# Altium schematic sheet motor_drivers.SchDoc
size A4; SheetNumber: 3; SheetTotal: 3
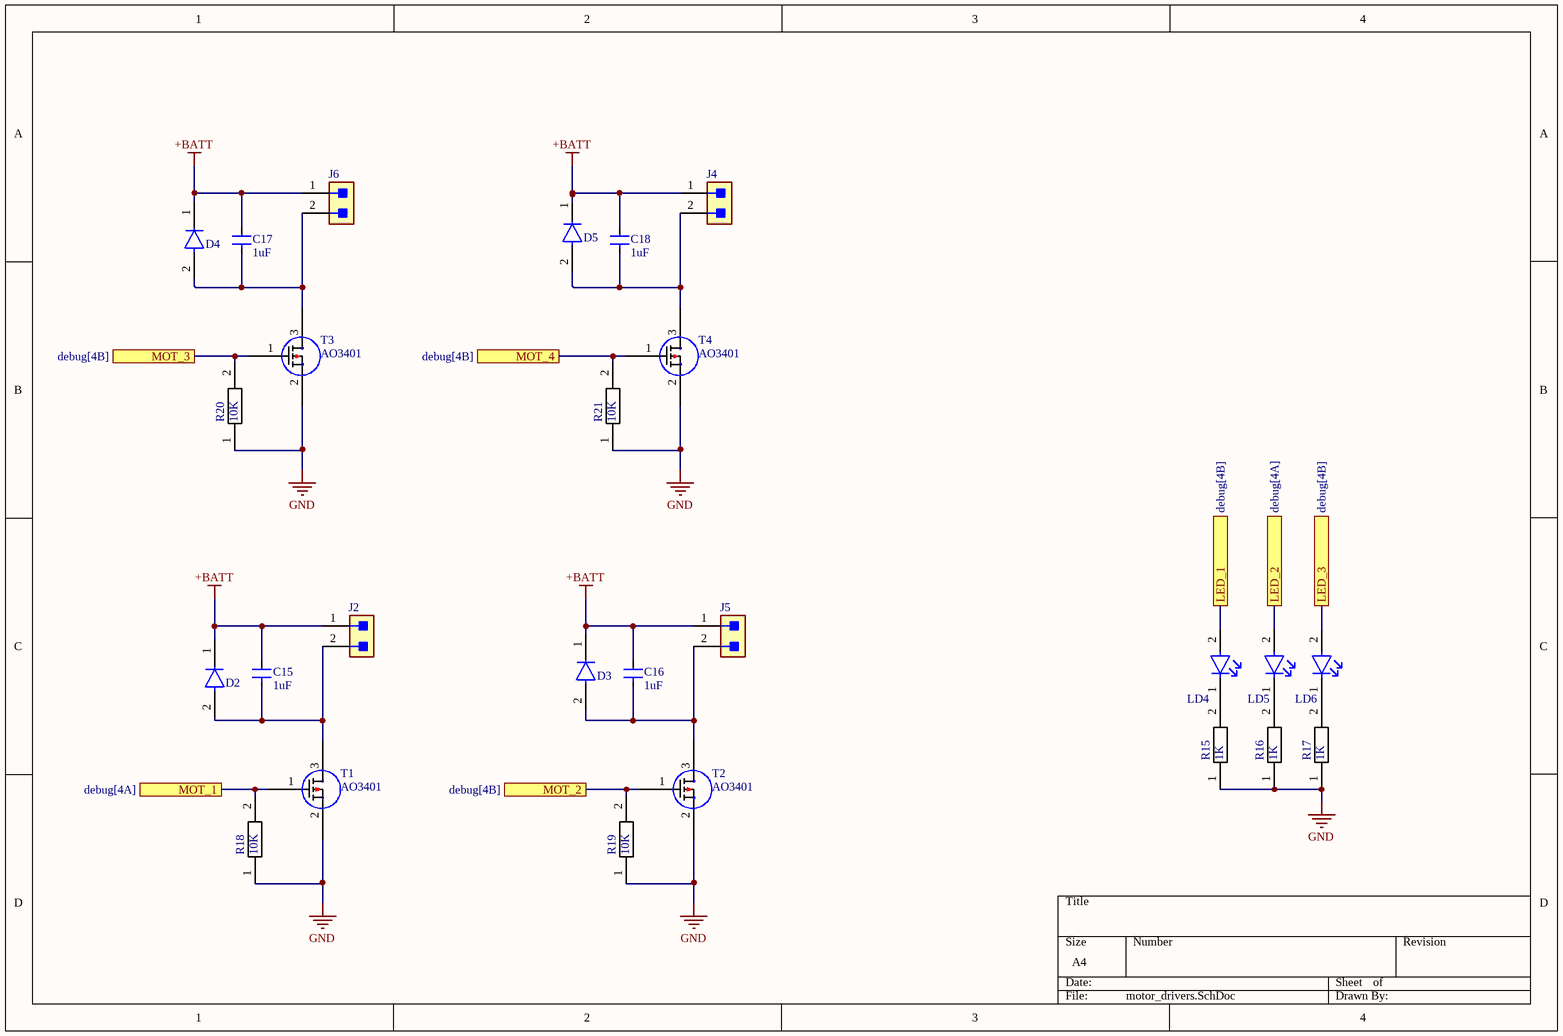
[diagram p0: motor_drivers.SchDoc]

## Parts
C15  1uF  [res0805ph]
C16  1uF  [res0805ph]
C17  1uF  [res0805ph]
C18  1uF  [res0805ph]
D2  APT1608ZGCK  [SOD3715X135N]  (value not drawn)
D3  APT1608ZGCK  [SOD3715X135N]  (value not drawn)
D4  APT1608ZGCK  [SOD3715X135N]  (value not drawn)
D5  APT1608ZGCK  [SOD3715X135N]  (value not drawn)
J2  TMM-102-02-L-S  [JST_B2B-XH-A_(LF)(SN)]  (value not drawn)
J4  TMM-102-02-L-S  [JST_B2B-XH-A_(LF)(SN)]  (value not drawn)
J5  TMM-102-02-L-S  [JST_B2B-XH-A_(LF)(SN)]  (value not drawn)
J6  TMM-102-02-L-S  [JST_B2B-XH-A_(LF)(SN)]  (value not drawn)
LD4  APT1608ZGCK  [res0805ph]  (value not drawn)
LD5  APT1608ZGCK  [res0805ph]  (value not drawn)
LD6  APT1608ZGCK  [res0805ph]  (value not drawn)
R15  1K  [res0805ph]
R16  1K  [res0805ph]
R17  1K  [res0805ph]
R18  10K  [res0805ph]
R19  10K  [res0805ph]
R20  10K  [res0805ph]
R21  10K  [res0805ph]
T1  AO3401  [NXP-SOT23_N]
T2  AO3401  [NXP-SOT23_N]
T3  AO3401  [NXP-SOT23_N]
T4  AO3401  [NXP-SOT23_N]

## Ports
LED_1 (see debug[4B]), LED_2 (see debug[4A]), LED_3 (see debug[4B]), MOT_1 (see debug[4A]), MOT_2 (see debug[4B]), MOT_3 (see debug[4B]), MOT_4 (see debug[4B])

## Nets
+BATT: C15.2 C16.2 C17.2 C18.2 D2.1(C) D3.1(C) D4.1(C) D5.1(C) J2.1 J4.1 J5.1 J6.1
GND: R15.1 R16.1 R17.1 R18.1 R19.1 R20.1 R21.1 T1.2 T2.2 T3.2 T4.2
LED_1: LD4.2(A) ; port LED_1
LED_2: LD5.2(A) ; port LED_2
LED_3: LD6.2(A) ; port LED_3
MOT_1: R18.2 T1.1 ; port MOT_1
MOT_2: R19.2 T2.1 ; port MOT_2
MOT_3: R20.2 T3.1 ; port MOT_3
MOT_4: R21.2 T4.1 ; port MOT_4
NetC15_1: C15.1 D2.2(A) J2.2 T1.3
NetC16_1: C16.1 D3.2(A) J5.2 T2.3
NetC17_1: C17.1 D4.2(A) J6.2 T3.3
NetC18_1: C18.1 D5.2(A) J4.2 T4.3
NetLD4_1: LD4.1(C) R15.2
NetLD5_1: LD5.1(C) R16.2
NetLD6_1: LD6.1(C) R17.2

## Library data of the parts
C15-C18 = CER Capacitor_1: Voltage Rating (DC): 35V; Tolerance: 20%; Capacitance: 10uF; Dielectric: X6S; Width: 0.049inch; Thickness: 0.057inch; Voltage Rating: 35V; Min Operating Temperature: -55°C; Case Code (Imperial): 0805; Mount: Surface Mount; Packaging: Tape and Reel; Case/Package: 0805; Max Operating Temperature: 105°C; Length: 0.079inch; Case Code (Metric): 2012
D2-D5 = 1N4148W: Diode; Forward Voltage: 3.3V; Lens Transparency: Clear; Color: Green; Dominant Wavelength: 525nm; Forward Current: 20mA; Lens Color: Colorless; Viewing Angle: 120°; Luminous Intensity: 350mcd; Max Operating Temperature: 85°C; Case/Package: 0603; Mount: Surface Mount; Min Operating Temperature: -40°C; Case Code (Metric): 1608; Test Current: 20mA; Packaging: Tape and Reel; Width: 0.8mm; Package Quantity: 1; Height: 0.75mm; Length: 1.6mm; Illumination Color: Green; Lead Free: Lead Free; Case Code (Imperial): 0603
J2 J4-J6 = Connector 1x2: CONN HEADER VERT 2POS 2MM; Max Voltage Rating (AC): 500V; Number of Contacts: 2; Max Current Rating: 3.9A; Gender: Male; Number of Rows: 1; REACH SVHC: No SVHC; Contact Material: Bronze; Length: 4mm; Depth: 1.97mm; Pitch: 2mm; Radiation Hardening: No; Contact Plating: Gold; Min Operating Temperature: -55°C; RoHS Compliant: Yes; Packaging: Bulk; Orientation: Straight; Housing Material: Polymer; Housing Color: Black; Max Operating Temperature: 125°C; Termination: Solder; Lead Free: Lead Free
LD4-LD6 = LED: LED GREEN CLEAR CHIP SMD; Forward Voltage: 3.3V; Dominant Wavelength: 525nm; Forward Current: 20mA; Lens Color: Colorless; Viewing Angle: 120°; Luminous Intensity: 350mcd; Lens Transparency: Clear; Color: Green; Max Operating Temperature: 85°C; Case/Package: 0603; Mount: Surface Mount; Min Operating Temperature: -40°C; Case Code (Metric): 1608; Test Current: 20mA; Packaging: Tape and Reel; Width: 0.8mm; Package Quantity: 1; Height: 0.75mm; Length: 1.6mm; Illumination Color: Green; Lead Free: Lead Free; Case Code (Imperial): 0603
R15-R21 = Weerstand: RES SMD 5.9K OHM 1% 1/4W 1206; Manufacturer: Yageo; Manufacturer Part Number: AC1206FR-075K9L; Resistance: 5.9KΩ; Power Rating: 0.25W; Voltage Rating: 200V; Automotive Grade: Grade 0; Value: 5.9KΩ; Tolerance: 0.01; Series: AC; Mouser Description: Thick Film Resistors - SMD 1/4W 5.9ohm 1% AEC-Q200; Lead Free: Yes; Octopart: https://octopart.com/ac1206fr-075k9l-yageo-30511161; Automotive: Yes; Temperature Range High: +155°C; ComponentLink2Description: Datasheet; Ipc Land Pattern Name: RESC310160X55; Temperature Range Low: -55°C; Digikey Description: RES SMD 5.9K OHM 1% 1/4W 1206; Device Class L3: Chip SMD Resistors; Device Class L2: Resistors; Category: Res; RoHS: TRUE; Height: 0.65mm; Package: AC1206; Temperature: -55°C to +155°C; ComponentLink2URL: http://www.yageo.com/NewPortal/yageodocoutput?fileName=/pdf/R-Chip/PYu-AC_51_RoHS_L_6.pdf; Device Class L1: Passive Components; Footprint Url: http://www.yageo.com/exep/pages/download/literatures/PYu-R_Mount_10.pdf; Composition: Thick Film
T1-T4 = SI2302DS-T1